# Altium project goalLight_PCB.PrjPCB
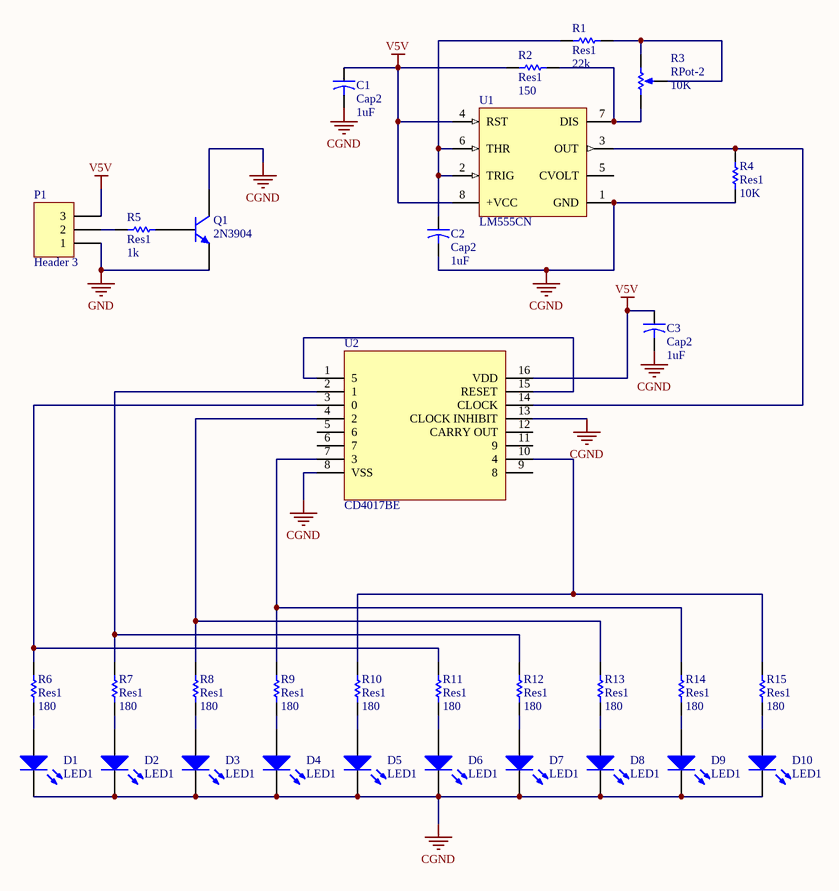
[diagram p0: goalLight.SchDoc]
1 sheet, 32 parts. Net scope: global (net labels, ports and power ports of the same name join across sheets).
Board file: goalLight.PcbDoc

## Sheet goalLight.SchDoc
size A

### Parts
C1  Cap2  value 1uF  [CAPR5-4X5]
C2  Cap2  value 1uF  [CAPR5-4X5]
C3  Cap2  value 1uF  [CAPR5-4X5]
D1  LED1  [LED-1]
D2  LED1  [LED-1]
D3  LED1  [LED-1]
D4  LED1  [LED-1]
D5  LED1  [LED-1]
D6  LED1  [LED-1]
D7  LED1  [LED-1]
D8  LED1  [LED-1]
D9  LED1  [LED-1]
D10  LED1  [LED-1]
P1  Header 3  [HDR1X3]
Q1  2N3904  [TO-92A]
R1  Res1  value 22k  [AXIAL-0.4]
R2  Res1  value 150  [AXIAL-0.4]
R3  RPot-2  value 10K  [POT3]
R4  Res1  value 10K  [AXIAL-0.4]
R5  Res1  value 1k  [AXIAL-0.4]
R6  Res1  value 180  [AXIAL-0.4]
R7  Res1  value 180  [AXIAL-0.4]
R8  Res1  value 180  [AXIAL-0.4]
R9  Res1  value 180  [AXIAL-0.4]
R10  Res1  value 180  [AXIAL-0.4]
R11  Res1  value 180  [AXIAL-0.4]
R12  Res1  value 180  [AXIAL-0.4]
R13  Res1  value 180  [AXIAL-0.4]
R14  Res1  value 180  [AXIAL-0.4]
R15  Res1  value 180  [AXIAL-0.4]
U1  LM555CN  [N08E]
U2  CD4017BE  [N16]

### Nets
CGND: C1.2 C2.2 C3.2 D1.2(K) D2.2(K) D3.2(K) D4.2(K) D5.2(K) D6.2(K) D7.2(K) D8.2(K) D9.2(K) D10.2(K) Q1.3(C) R4.1 U1.1(GND) U2.8(VSS) U2.13(CLOCK_INHIBIT)
GND: P1.1 Q1.1(E)
V5V: C1.1 C3.1 P1.3 R2.2 U1.4(RST) U1.8(+VCC) U2.16(VDD)
NetC2_1: C2.1 R1.2 U1.2(TRIG) U1.6(THR)
NetD1_1: D1.1(A) R6.1
NetD2_1: D2.1(A) R7.1
NetD3_1: D3.1(A) R8.1
NetD4_1: D4.1(A) R9.1
NetD5_1: D5.1(A) R10.1
NetD6_1: D6.1(A) R11.1
NetD7_1: D7.1(A) R12.1
NetD8_1: D8.1(A) R13.1
NetD9_1: D9.1(A) R14.1
NetD10_1: D10.1(A) R15.1
NetP1_2: P1.2 R5.2
NetQ1_2: Q1.2(B) R5.1
NetR1_1: R1.1 R3.2(BOT) R3.3(TAP)
NetR2_1: R2.1 R3.1(TOP) U1.7(DIS)
NetR4_2: R4.2 U1.3(OUT) U2.14(CLOCK)
NetR6_2: R6.2 R11.2 U2.3(0)
NetR7_2: R7.2 R12.2 U2.2(1)
NetR8_2: R8.2 R13.2 U2.4(2)
NetR9_2: R9.2 R14.2 U2.7(3)
NetR10_2: R10.2 R15.2 U2.10(4)
NetU2_1: U2.1(5) U2.15(RESET)

Not connected (* = marked no-connect by the designer): U1 5(CVOLT); U2 5(6) 6(7) 9(8) 11(9) 12(CARRY_OUT)

### Library data of the parts
C1-C3 = Cap2: Capacitor; Published: 23-Sep-2002; PackageReference: CAPR5-4X5; Publisher: Altium Limited; PackageDescription: Capacitor; 2 Leads
D1-D10 = LED1: Typical RED GaAs LED; Published: 8-Jun-2000; LatestRevisionDate: 08-Jul-2005; LatestRevisionNote: Mech Layer 1 removed.; PackageReference: LED-1; Publisher: Altium Limited; PackageDescription: LED; 2 Leads
P1 = Header 3: Header, 3-Pin; LatestRevisionDate: 17-Jul-2002; LatestRevisionNote: Re-released for DXP Platform.; Publisher: Altium Limited
Q1 = 2N3904: NPN General Purpose Amplifier; Published: 8-Jun-2000; LatestRevisionDate: 15-Jan-2003; LatestRevisionNote: PCB Footprint 'BCY-W3/D4.7' replaced; DatasheetVersion: 1997; PackageVersion: Sep-1998; PackageReference: TO-92A; Publisher: Altium Limited; PackageDescription: TO, Flat Index; 3 In-Line, Axial Leads; Body Dia. 4.5mm; Leads 0.51 x 0.48 mm (max); ComponentLink1Description: Manufacturer Link; ComponentLink1URL: http://www.fairchildsemi.com/; ComponentLink2Description: Datasheet; ComponentLink2URL: http://www.fairchildsemi.com/ds/2N%2F2N3904.pdf
R1 R2 R4-R15 = Res1: Resistor; Published: 8-Jun-2000; LatestRevisionDate: 17-Jul-2002; LatestRevisionNote: Re-released for DXP Platform.; PackageReference: AXIAL-0.3; Publisher: Altium Limited; PackageDescription: Axial Device, Thru-Hole; 2 Leads; 0.3 in Pin Spacing
R3 = RPot-2: Potentiometer; Sim Note: Enter the Resistance value and the set point into parameter fields.; Set Position: 0.5; Published: 8-Jun-2000; LatestRevisionDate: 17-Jul-2002; LatestRevisionNote: Re-released for DXP Platform.; PackageReference: VR5; Publisher: Altium Limited; PackageDescription: Variable Resistor, Thru-Hole; 3 Leads
U1 = LM555CN: Timer, 8-pin MDIP; Manufacturer: National Semiconductor; PackageTopMarking: NSUZXYTTE#*LM*555CN; PowerWise: N; CompType: Analog IC; Published: 4-Dec-2008; DatasheetVersion: Jul-2006; PackageVersion: revG, May-2006; PackageReference: N08E; Publisher: Altium Limited; PackageDescription: MDIP, .365 x .250 x .130in, 8 Lead, .100in Pitch; Supplier 1: Farnell; Supplier Part Number 1: 9488235; PartNumber: LM555CN; RoHS: N; PinCount: 8; Code_JEDEC: MS-001-BA; ComponentLink1Description: LM555 Datasheet; ComponentLink1URL: http://www.national.com/ds/LM/LM555.pdf; ComponentLink2Description: LM555 Web Page; ComponentLink2URL: http://www.national.com/pf/LM/LM555.html; ComponentLink3Description: N08E Package Page; ComponentLink3URL: http://www.national.com/packaging/folders/n08e.html
U2 = CD4017BE: Decade Counter